# Altium project LCD_BS.PrjPcb
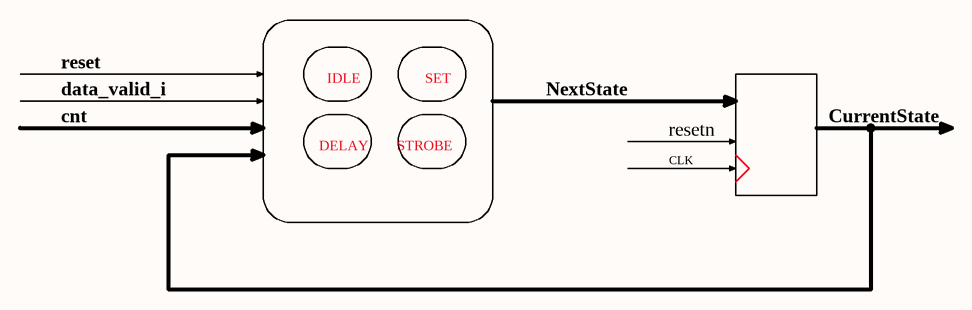
[diagram p0: FSM.SchDoc]
4 sheets, 1 parts. Net scope: hierarchical (ports join the sheet entries above them; power ports are global).
Sheets:
  FSM.SchDoc
  LCD_FSM.SchDoc
  LCD_Init.SchDoc
  datage_drv_tb_bs.SchDoc

## Sheet FSM.SchDoc
size A4

### Notes on the sheet
- data_valid_i
- cnt
- reset
- IDLE
- SET
- NextState
- CurrentState
- DELAY
- STROBE
- resetn
- CLK

## Sheet LCD_FSM.SchDoc
size A4
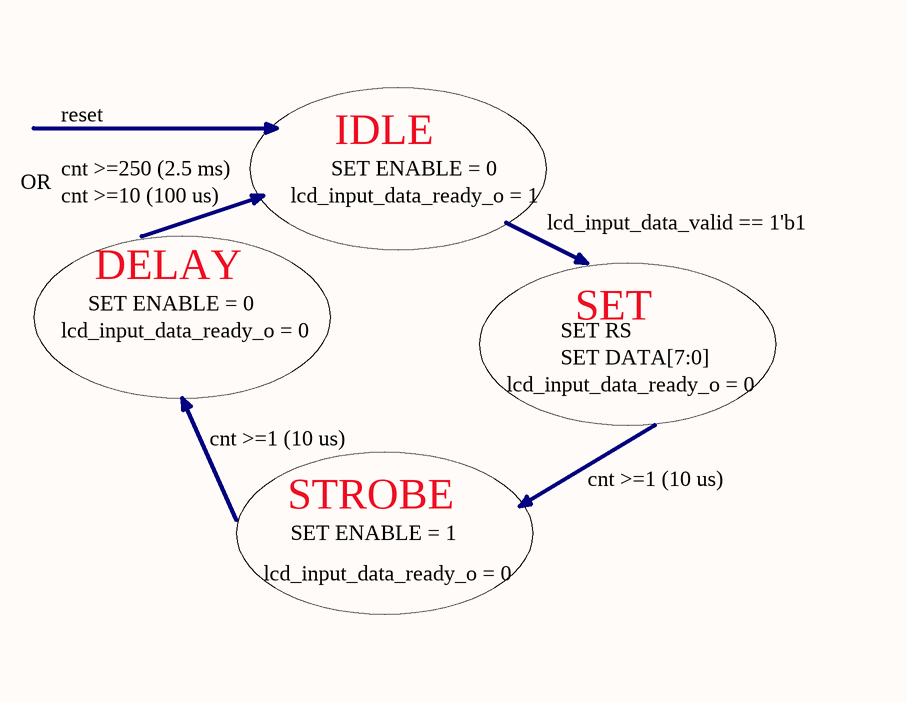
[diagram p1: LCD_FSM.SchDoc]

### Notes on the sheet
- reset
- cnt >=250 (2.5 ms)
- SET ENABLE = 0
- IDLE
- OR
- cnt >=10 (100 us)
- lcd_input_data_ready_o = 1
- lcd_input_data_valid == 1'b1
- DELAY
- lcd_input_data_ready_o = 0
- SET RS
- SET DATA[7:0]
- SET
- cnt >=1 (10 us)
- STROBE
- SET ENABLE = 1

## Sheet LCD_Init.SchDoc
size A4
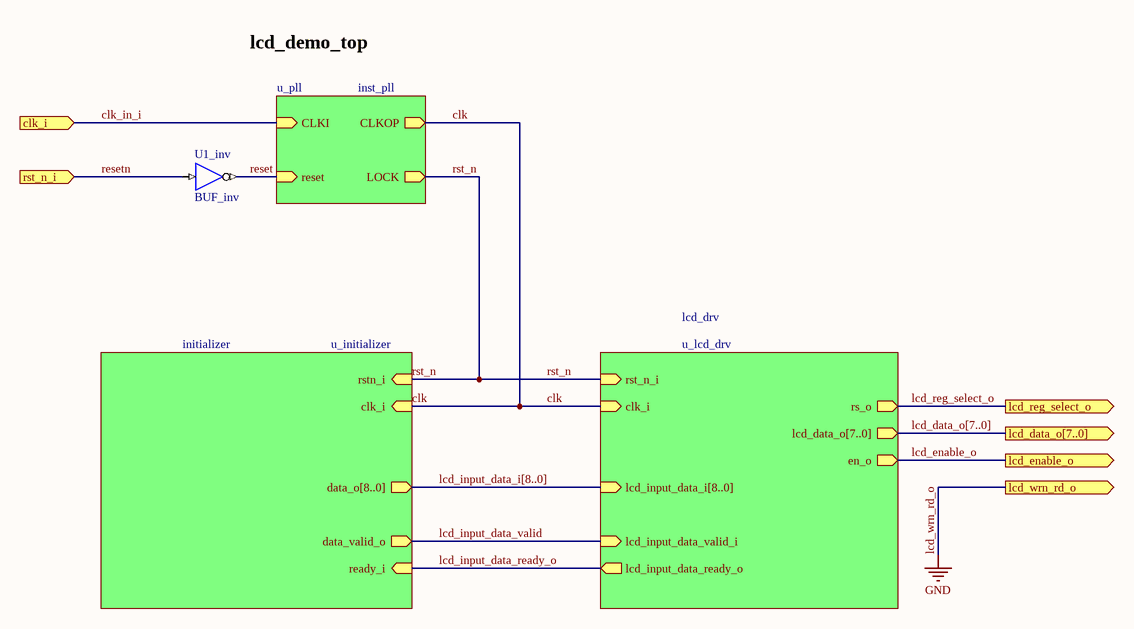
[diagram p2: LCD_Init.SchDoc]

### Parts
U1_inv  BUF_inv

### Sub-sheets
initializer = u_initializer (file not in this document): data_o[8..0] (out), data_valid_o (out), ready_i (in), clk_i (in), rstn_i (in)
lcd_drv = u_lcd_drv (file not in this document): rs_o (out), lcd_data_o[7..0] (out), en_o (out), clk_i (in), lcd_input_data_i[8..0] (in), lcd_input_data_valid_i (in), lcd_input_data_ready_o (out), rst_n_i (in)
u_pll = inst_pll (file not in this document): CLKI (in), CLKOP (out), LOCK (out), reset (in)

### Ports
clk_i (in), lcd_data_o[7..0] (out), lcd_enable_o (out), lcd_reg_select_o (out), lcd_wrn_rd_o (out), rst_n_i (in)

### Nets
lcd_wrn_rd_o: port lcd_wrn_rd_o  [also labelled GND]
clk: sheet lcd_drv/clk_i, sheet initializer/clk_i, sheet u_pll/CLKOP
clk_in_i: port clk_i, sheet u_pll/CLKI
lcd_enable_o: port lcd_enable_o, sheet lcd_drv/en_o
lcd_input_data_ready_o: sheet lcd_drv/lcd_input_data_ready_o, sheet initializer/ready_i
lcd_input_data_valid: sheet lcd_drv/lcd_input_data_valid_i, sheet initializer/data_valid_o
lcd_reg_select_o: port lcd_reg_select_o, sheet lcd_drv/rs_o
reset: U1_inv.O ; sheet u_pll/reset
resetn: U1_inv.I ; port rst_n_i
rst_n: sheet lcd_drv/rst_n_i, sheet initializer/rstn_i, sheet u_pll/LOCK

### Buses and harness runs
bus lcd_data_o[7..0] = port lcd_data_o[7..0] = sheet lcd_drv/lcd_data_o[7..0]
bus lcd_input_data_i[8..0] = sheet initializer/data_o[8..0] = sheet lcd_drv/lcd_input_data_i[8..0]

### Notes on the sheet
- lcd_demo_top

### Library data of the parts
U1_inv = BUF_inv: 1-bit General Purpose (Non-inverting) Buffer

## Sheet datage_drv_tb_bs.SchDoc
size A4
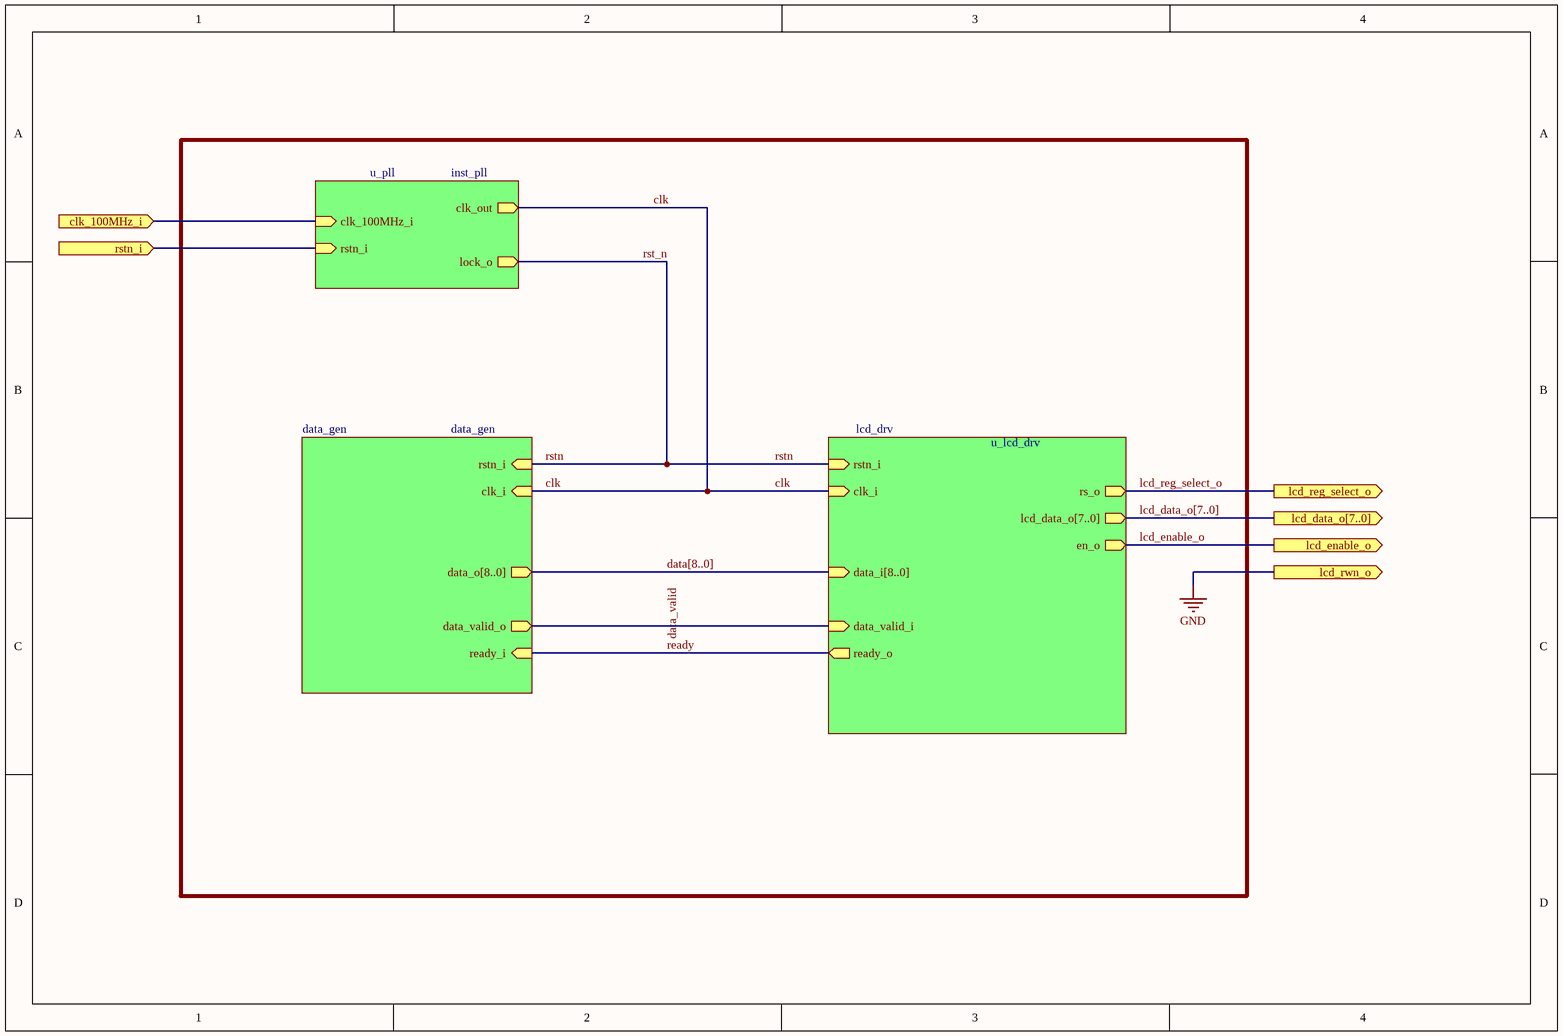
[diagram p3: datage_drv_tb_bs.SchDoc]

### Sub-sheets
data_gen = data_gen (file not in this document): data_o[8..0] (out), data_valid_o (out), ready_i (in), clk_i (in), rstn_i (in)
lcd_drv = u_lcd_drv (file not in this document): rs_o (out), lcd_data_o[7..0] (out), en_o (out), clk_i (in), data_i[8..0] (in), data_valid_i (in), ready_o (out), rstn_i (in)
u_pll = inst_pll (file not in this document): clk_out (out), lock_o (out), clk_100MHz_i (in), rstn_i (in)

### Ports
clk_100MHz_i (in), lcd_data_o[7..0] (out), lcd_enable_o (out), lcd_reg_select_o (out), lcd_rwn_o (out), rstn_i (in)

### Nets
GND: port lcd_rwn_o  [project net lcd_wrn_rd_o]
clk: sheet lcd_drv/clk_i, sheet data_gen/clk_i, sheet u_pll/clk_out
lcd_enable_o: port lcd_enable_o, sheet lcd_drv/en_o
lcd_reg_select_o: port lcd_reg_select_o, sheet lcd_drv/rs_o
ready: sheet lcd_drv/ready_o, sheet data_gen/ready_i
rst_n: sheet lcd_drv/rstn_i, sheet data_gen/rstn_i, sheet u_pll/lock_o  [also labelled rstn]
(unnamed): port clk_100MHz_i, sheet u_pll/clk_100MHz_i
(unnamed): port rstn_i, sheet u_pll/rstn_i
(unnamed): sheet lcd_drv/data_valid_i, sheet data_gen/data_valid_o

### Buses and harness runs
bus data[8..0] = sheet data_gen/data_o[8..0] = sheet lcd_drv/data_i[8..0]
bus lcd_data_o[7..0] = port lcd_data_o[7..0] = sheet lcd_drv/lcd_data_o[7..0]

### Notes on the sheet
- Labels drawn without touching a wire or pin: data_valid